# Altium schematic sheet main.SchDoc: Main Schema Block
size A3; SheetNumber: 2; SheetTotal: 17
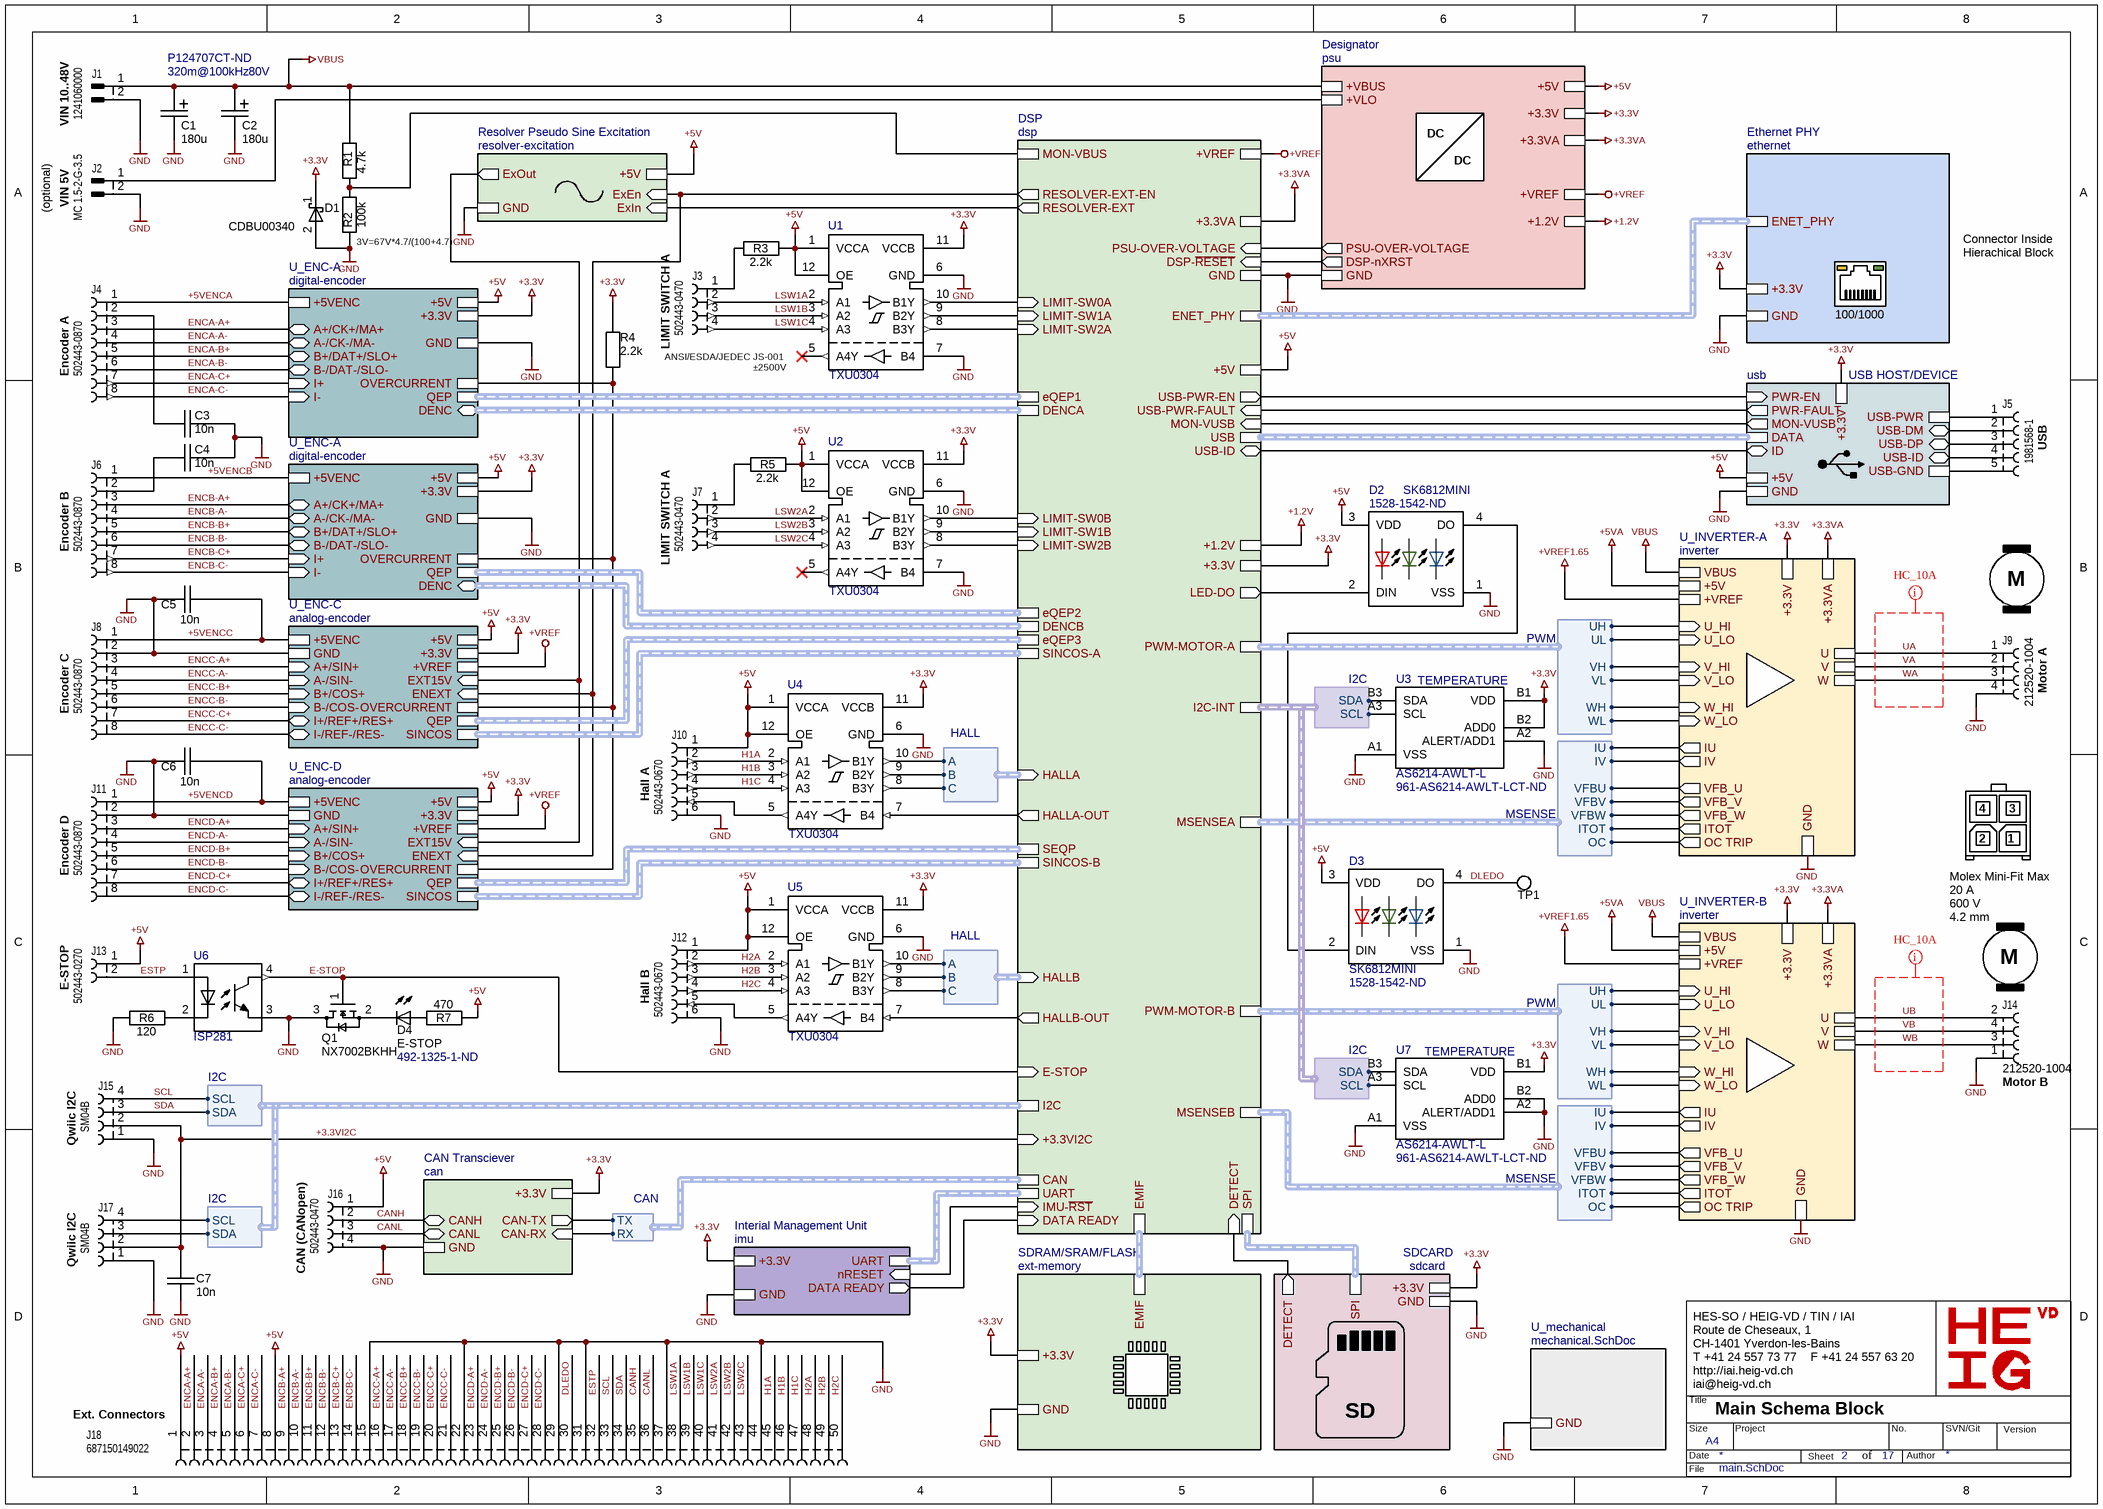
[diagram p0: main.SchDoc]

## Parts
C1  180u  Voltage: 80V  ESR: 320m@100kHz  Supplier Part Number 1: P124707CT-ND  [CAP_EEEFK1K151AV]
C2  180u  [CAP_EEEFK1K151AV]
C3  10n  [SM/C0402]
C4  10n  [SM/C0402]
C5  10n  [SM/C0402]
C6  10n  [SM/C0402]
C7  10n  [SM/C0402]
D1  CDBU00340  [SM/D0603/SOD523F]
D2  SK6812MINI  Supplier Part Number 1: 1528-1542-ND  [LED_SK6812]
D3  SK6812MINI  Supplier Part Number 1: 1528-1542-ND  [LED_SK6812]
D4  E-STOP  Supplier Part Number 1: 492-1325-1-ND  [SM/LED0603]
J1  1241060000  Function: VIN 10..48V  [CONN 2POS WEIDMULLER 5.08mm]
J2  MC 1.5-2-G-3.5  Function: VIN 5V  [CONN2/PHOENIX/MC 1.5-2-G-3.5]
J3  502443-0470  Function: LIMIT SWITCH A  [MOLEX/5024430470/CLIK-MATE/2mm]
J4  502443-0870  Function: Encoder A  [MOLEX/5024430870/CLIK-MATE/2mm]
J5  1981568-1  Function: USB  [TE/1981568-1/USB]
J6  502443-0870  Function: Encoder B  [MOLEX/5024430870/CLIK-MATE/2mm]
J7  502443-0470  Function: LIMIT SWITCH A  [MOLEX/5024430470/CLIK-MATE/2mm]
J8  502443-0870  Function: Encoder C  [MOLEX/5024430870/CLIK-MATE/2mm]
J9  212520-1004  Function: Motor A  [MOLEX/2125201004]
J10  502443-0670  Function: Hall A  [MOLEX/5024430670/CLIK-MATE/2mm]
J11  502443-0870  Function: Encoder D  [MOLEX/5024430870/CLIK-MATE/2mm]
J12  502443-0670  Function: Hall B  [MOLEX/5024430670/CLIK-MATE/2mm]
J13  502443-0270  Function: E-STOP  [MOLEX/5024430270/CLIK-MATE/2mm]
J14  212520-1004  Function: Motor B  [MOLEX/2125201004]
J15  SM04B  Function: Qwiic I2C  [QWIIC-SM04B-SRSS-TB]
J16  502443-0470  Function: CAN (CANopen)  [MOLEX/5024430470/CLIK-MATE/2mm]
J17  SM04B  Function: Qwiic I2C  [QWIIC-SM04B-SRSS-TB]
J18  687150149022  Function: Ext. Connectors  [687150149022]
Q1  NX7002BKHH  [SOT8001/DFN0606-3]
R1  4.7k  [SM/R0402]
R2  100k  [SM/R0805]
R3  2.2k  [SM/R0402]
R4  2.2k  [SM/R0402]
R5  2.2k  [SM/R0402]
R6  120  [SM/R0402]
R7  470  [SM/R0603]
TP1  RCUCTE  [TP/RCUCT]  (value not drawn)
U1  TXU0304  [QFN40P170X200X55-12N]
U2  TXU0304  [QFN40P170X200X55-12N]
U3  AS6214-AWLT-L  Supplier Part Number 1: 961-AS6214-AWLT-LCT-ND  [AS6214-AWLT-L_AMS]
U4  TXU0304  [QFN40P170X200X55-12N]
U5  TXU0304  [QFN40P170X200X55-12N]
U6  ISP281  [SOIC-4]
U7  AS6214-AWLT-L  Supplier Part Number 1: 961-AS6214-AWLT-LCT-ND  [AS6214-AWLT-L_AMS]

## Sub-sheets
CAN Transciever = can: CANL (bidir), CAN-RX (in), CANH (bidir), GND, CAN-TX (out), +3.3V
Designator = psu: DSP-nXRST (out), +3.3VA, +1.2V, +VBUS, +VLO, GND, +3.3V, +5V, +VREF, PSU-OVER-VOLTAGE (out)
DSP = dsp: SINCOS-B (harness SINCOS), MSENSEB (harness MSENSE), MSENSEA (harness MSENSE), SINCOS-A (harness SINCOS), I2C (harness I2C), EMIF (harness EMIF), PWM-MOTOR-A (harness PWM), CAN (harness CAN), ENET_PHY (harness ETHERNET), PWM-MOTOR-B (harness PWM), +3.3VI2C (in), USB-PWR-EN (out), USB-ID (bidir), USB-PWR-FAULT (in), USB (harness USB), HALLA (in, harness HALL), HALLB (in, harness HALL), LIMIT-SW0A (in), LIMIT-SW1A (in), LIMIT-SW2A (in), LIMIT-SW0B (in), LIMIT-SW1B (in), LIMIT-SW2B (in), eQEP3 (harness EQEP), SPI (harness SPI), eQEP2 (harness EQEP), E-STOP (in), eQEP1 (harness EQEP), DATA READY (in), +3.3V, +3.3VA, GND, +1.2V, +5V, HALLA-OUT (out), HALLB-OUT (out), I2C-INT (harness I2C), LED-DO (out), UART (harness UART), RESOLVER-EXT-EN (out), RESOLVER-EXT (out), IMU-~{RST} (in), DSP-~{RESET} (in), PSU-OVER-VOLTAGE (in), DENCA (harness DENC), SEQP (harness EQEP), DETECT (in), MON-VBUS, MON-VUSB (in), DENCB (harness DENC), +VREF
Ethernet PHY = ethernet: GND, ENET_PHY (harness ETHERNET), +3.3V
Interial Management Unit = imu: DATA READY (out), nRESET (in), UART (harness UART), GND, +3.3V
Resolver Pseudo Sine Excitation = resolver-excitation: ExEn (in), +5V, ExOut (out), GND, ExIn (in)
SDCARD = sdcard: +3.3V, SPI (harness SPI), GND, DETECT (out)
SDRAM/SRAM/FLASH = ext-memory: +3.3V, EMIF (harness EMIF), GND
U_ENC-A = digital-encoder: I+ (in), +5VENC, +3.3V, +5V, I- (in), B+/DAT+/SLO+ (bidir), A-/CK-/MA- (bidir), A+/CK+/MA+ (bidir), B-/DAT-/SLO- (bidir), DENC (bidir, harness DENC), QEP (harness EQEP), GND, OVERCURRENT
U_ENC-A = digital-encoder: I+ (in), +5VENC, +3.3V, +5V, I- (in), B+/DAT+/SLO+ (bidir), A-/CK-/MA- (bidir), A+/CK+/MA+ (bidir), B-/DAT-/SLO- (bidir), DENC (bidir, harness DENC), QEP (harness EQEP), GND, OVERCURRENT
U_ENC-C = analog-encoder: SINCOS (harness SINCOS), +5VENC, EXT15V (in), OVERCURRENT, +3.3V, +5V, I+/REF+/RES+ (bidir), I-/REF-/RES- (bidir), B-/COS- (in), B+/COS+ (in), A+/SIN+ (in), A-/SIN- (in), ENEXT (in), +VREF, GND, QEP (harness EQEP)
U_ENC-D = analog-encoder: SINCOS (harness SINCOS), +5VENC, EXT15V (in), OVERCURRENT, +3.3V, +5V, I+/REF+/RES+ (bidir), I-/REF-/RES- (bidir), B-/COS- (in), B+/COS+ (in), A+/SIN+ (in), A-/SIN- (in), ENEXT (in), +VREF, GND, QEP (harness EQEP)
U_INVERTER-A = inverter: U_LO (in), V_HI (in), U, VBUS, V, IU (out), W, V_LO (in), IV (out), U_HI (in), W_HI (in), W_LO (in), OC TRIP (out), VFB_W (out), ITOT (out), VFB_V (out), VFB_U (out), GND, +3.3V, +5V, +VREF, +3.3VA
U_INVERTER-B = inverter: U_LO (in), V_HI (in), U, VBUS, V, IU (out), W, V_LO (in), IV (out), U_HI (in), W_HI (in), W_LO (in), OC TRIP (out), VFB_W (out), ITOT (out), VFB_V (out), +VREF, VFB_U (out), +5V, GND, +3.3V, +3.3VA
U_mechanical = mechanical.SchDoc: GND
USB HOST/DEVICE = usb: GND, +5V, USB-DP (bidir), USB-DM (bidir), USB-PWR, USB-GND, USB-ID (bidir), PWR-EN (in), MON-VUSB (out), ID (bidir), DATA (harness USB), PWR-FAULT (out), +3.3V

## Harnesses
I2C: SCL, SDA
CAN: RX, TX
PWM: UH, UL, VH, VL, WH, WL
MSENSE: IU, IV, VFBU, VFBV, ITOT, OC, VFBW
HALL: A, B, C

## Nets
+1.2V: sheet DSP/+1.2V, sheet Designator/+1.2V
+3.3V: D1.1(K) R4.2 U1.11(VCCB) U2.11(VCCB) U3.B1(VDD) U3.B2(ADD0) U4.11(VCCB) U5.11(VCCB) U7.B1(VDD) ; sheet U_INVERTER-A/+3.3V, sheet U_ENC-A/+3.3V, sheet CAN Transciever/+3.3V, sheet U_INVERTER-B/+3.3V, sheet DSP/+3.3V, sheet Ethernet PHY/+3.3V, sheet Designator/+3.3V, sheet SDRAM/SRAM/FLASH/+3.3V, sheet USB HOST/DEVICE/+3.3V, sheet U_ENC-C/+3.3V, sheet Interial Management Unit/+3.3V, sheet U_ENC-A/+3.3V, sheet SDCARD/+3.3V, sheet U_ENC-D/+3.3V
+3.3VA: sheet U_INVERTER-A/+3.3VA, sheet U_INVERTER-B/+3.3VA, sheet DSP/+3.3VA, sheet Designator/+3.3VA
+5V: D2.3(VDD) D3.3(VDD) J10.1 J12.1 J13.1 J16.1 J18.1 J18.8 R3.2 R5.2 R7.2 U1.1(VCCA) U1.12(OE) U2.1(VCCA) U2.12(OE) U4.1(VCCA) U4.12(OE) U5.1(VCCA) U5.12(OE) ; sheet U_ENC-A/+5V, sheet DSP/+5V, sheet Designator/+5V, sheet USB HOST/DEVICE/+5V, sheet Resolver Pseudo Sine Excitation/+5V, sheet U_ENC-C/+5V, sheet U_ENC-A/+5V, sheet U_ENC-D/+5V
+5VA: sheet U_INVERTER-A/+5V, sheet U_INVERTER-B/+5V
+VREF: sheet DSP/+VREF, sheet Designator/+VREF, sheet U_ENC-C/+VREF, sheet U_ENC-D/+VREF
+VREF1.65: sheet U_INVERTER-A/+VREF, sheet U_INVERTER-B/+VREF
GND: C1.2(-) C2.2(-) C3.1 C4.1 C5.2 C6.2 C7.2 D1.2(A) D2.1(VSS) D3.1(VSS) J1.2 J2.2 J8.2 J9.4 J10.6 J11.2 J12.6 J14.1 J15.1 J16.4 J17.1 J18.15 J18.22 J18.29 J18.31 J18.37 J18.44 Q1.3(VCC) R2.2 R6.1 U1.6(GND) U1.7(B4) U2.6(GND) U2.7(B4) U3.A1(VSS) U3.A2(ALERT/ADD1) U4.6(GND) U5.6(GND) U6.3(E) U7.A1(VSS) U7.A2(ALERT/ADD1) U7.B2(ADD0) ; sheet U_INVERTER-A/GND, sheet U_ENC-A/GND, sheet CAN Transciever/GND, sheet U_INVERTER-B/GND, sheet DSP/GND, sheet Ethernet PHY/GND, sheet Designator/GND, sheet SDRAM/SRAM/FLASH/GND, sheet USB HOST/DEVICE/GND, sheet Resolver Pseudo Sine Excitation/GND, sheet U_ENC-C/GND, sheet Interial Management Unit/GND, sheet U_ENC-A/GND, sheet SDCARD/GND, sheet U_ENC-D/GND, sheet U_mechanical/GND
VBUS: C1.1(+) C2.1(+) J1.1 R1.1 ; sheet U_INVERTER-A/VBUS, sheet U_INVERTER-B/VBUS, sheet Designator/+VBUS
+3.3VI2C: C7.1 J15.2 J17.2 ; sheet DSP/+3.3VI2C
+5VENCA: J4.1 ; sheet U_ENC-A/+5VENC
+5VENCB: J6.1 ; sheet U_ENC-A/+5VENC
+5VENCC: C5.1 J8.1 ; sheet U_ENC-C/+5VENC
+5VENCD: C6.1 J11.1 ; sheet U_ENC-D/+5VENC
CANH: J16.2 J18.35 ; sheet CAN Transciever/CANH
CANL: J16.3 J18.36 ; sheet CAN Transciever/CANL
DLEDO: D3.4(DO) J18.30 TP1.1
E-STOP: Q1.1(VCC) U6.4(C) ; sheet DSP/E-STOP
ENCA-A+: J4.3 J18.2 ; sheet U_ENC-A/A+/CK+/MA+
ENCA-A-: J4.4 J18.3 ; sheet U_ENC-A/A-/CK-/MA-
ENCA-B+: J4.5 J18.4 ; sheet U_ENC-A/B+/DAT+/SLO+
ENCA-B-: J4.6 J18.5 ; sheet U_ENC-A/B-/DAT-/SLO-
ENCA-C+: J4.7 J18.6 ; sheet U_ENC-A/I+
ENCA-C-: J4.8 J18.7 ; sheet U_ENC-A/I-
ENCB-A+: J6.3 J18.9 ; sheet U_ENC-A/A+/CK+/MA+
ENCB-A-: J6.4 J18.10 ; sheet U_ENC-A/A-/CK-/MA-
ENCB-B+: J6.5 J18.11 ; sheet U_ENC-A/B+/DAT+/SLO+
ENCB-B-: J6.6 J18.12 ; sheet U_ENC-A/B-/DAT-/SLO-
ENCB-C+: J6.7 J18.13 ; sheet U_ENC-A/I+
ENCB-C-: J6.8 J18.14 ; sheet U_ENC-A/I-
ENCC-A+: J8.3 J18.16 ; sheet U_ENC-C/A+/SIN+
ENCC-A-: J8.4 J18.17 ; sheet U_ENC-C/A-/SIN-
ENCC-B+: J8.5 J18.18 ; sheet U_ENC-C/B+/COS+
ENCC-B-: J8.6 J18.19 ; sheet U_ENC-C/B-/COS-
ENCC-C+: J8.7 J18.20 ; sheet U_ENC-C/I+/REF+/RES+
ENCC-C-: J8.8 J18.21 ; sheet U_ENC-C/I-/REF-/RES-
ENCD-A+: J11.3 J18.23 ; sheet U_ENC-D/A+/SIN+
ENCD-A-: J11.4 J18.24 ; sheet U_ENC-D/A-/SIN-
ENCD-B+: J11.5 J18.25 ; sheet U_ENC-D/B+/COS+
ENCD-B-: J11.6 J18.26 ; sheet U_ENC-D/B-/COS-
ENCD-C+: J11.7 J18.27 ; sheet U_ENC-D/I+/REF+/RES+
ENCD-C-: J11.8 J18.28 ; sheet U_ENC-D/I-/REF-/RES-
ESTP: J13.2 J18.32 U6.1(A)
H1A: J10.2 J18.45 U4.2(A1)
H1B: J10.3 J18.46 U4.3(A2)
H1C: J10.4 J18.47 U4.4(A3)
H2A: J12.2 J18.48 U5.2(A1)
H2B: J12.3 J18.49 U5.3(A2)
H2C: J12.4 J18.50 U5.4(A3)
LSW1A: J3.2 J18.38 U1.2(A1)
LSW1B: J3.3 J18.39 U1.3(A2)
LSW1C: J3.4 J18.40 U1.4(A3)
LSW2A: J7.2 J18.41 U2.2(A1)
LSW2B: J7.3 J18.42 U2.3(A2)
LSW2C: J7.4 J18.43 U2.4(A3)
SCL: J15.4 J17.4 J18.33 ; sheet DSP/I2C.SCL
SDA: J15.3 J17.3 J18.34 ; sheet DSP/I2C.SDA
UA: J9.1 ; sheet U_INVERTER-A/U
UB: J14.2 ; sheet U_INVERTER-B/U
VA: J9.2 ; sheet U_INVERTER-A/V
VB: J14.4 ; sheet U_INVERTER-B/V
WA: J9.3 ; sheet U_INVERTER-A/W
WB: J14.3 ; sheet U_INVERTER-B/W
NetC3_2: C3.2 J4.2
NetC4_2: C4.2 J6.2
NetD2_2: D2.2(DIN) ; sheet DSP/LED-DO
NetD2_4: D2.4(DO) D3.2(DIN)
NetD4_1: D4.1 R7.1
NetD4_2: D4.2 Q1.2(VCC)
NetJ2_1: J2.1 ; sheet Designator/+VLO
NetJ3_1: J3.1 R3.1
NetJ5_1: J5.1 ; sheet USB HOST/DEVICE/USB-PWR
NetJ5_2: J5.2 ; sheet USB HOST/DEVICE/USB-DM
NetJ5_3: J5.3 ; sheet USB HOST/DEVICE/USB-DP
NetJ5_4: J5.4 ; sheet USB HOST/DEVICE/USB-ID
NetJ5_5: J5.5 ; sheet USB HOST/DEVICE/USB-GND
NetJ7_1: J7.1 R5.1
NetJ10_5: J10.5 U4.5(A4Y)
NetJ12_5: J12.5 U5.5(A4Y)
NetR1_2: R1.2 R2.1 ; sheet DSP/MON-VBUS
NetR4_1: R4.1 ; sheet U_ENC-A/OVERCURRENT, sheet U_ENC-C/OVERCURRENT, sheet U_ENC-A/OVERCURRENT, sheet U_ENC-D/OVERCURRENT
NetR6_2: R6.2 U6.2(K)
NetU1_8: U1.8(B3Y) ; sheet DSP/LIMIT-SW2A
NetU1_9: U1.9(B2Y) ; sheet DSP/LIMIT-SW1A
NetU1_10: U1.10(B1Y) ; sheet DSP/LIMIT-SW0A
NetU2_8: U2.8(B3Y) ; sheet DSP/LIMIT-SW2B
NetU2_9: U2.9(B2Y) ; sheet DSP/LIMIT-SW1B
NetU2_10: U2.10(B1Y) ; sheet DSP/LIMIT-SW0B
NetU3_A3: U3.A3(SCL) U7.A3(SCL) ; sheet DSP/I2C-INT.SCL
NetU3_B3: U3.B3(SDA) U7.B3(SDA) ; sheet DSP/I2C-INT.SDA
NetU4_7: U4.7(B4) ; sheet DSP/HALLA-OUT
NetU4_8: U4.8(B3Y) ; sheet DSP/HALLA.C
NetU4_9: U4.9(B2Y) ; sheet DSP/HALLA.B
NetU4_10: U4.10(B1Y) ; sheet DSP/HALLA.A
NetU5_7: U5.7(B4) ; sheet DSP/HALLB-OUT
NetU5_8: U5.8(B3Y) ; sheet DSP/HALLB.C
NetU5_9: U5.9(B2Y) ; sheet DSP/HALLB.B
NetU5_10: U5.10(B1Y) ; sheet DSP/HALLB.A
(unnamed): sheet U_INVERTER-A/U_LO, sheet DSP/PWM-MOTOR-A.UL
(unnamed): sheet U_INVERTER-A/V_HI, sheet DSP/PWM-MOTOR-A.VH
(unnamed): sheet U_INVERTER-A/IU, sheet DSP/MSENSEA.IU
(unnamed): sheet U_INVERTER-A/V_LO, sheet DSP/PWM-MOTOR-A.VL
(unnamed): sheet U_INVERTER-A/IV, sheet DSP/MSENSEA.IV
(unnamed): sheet U_INVERTER-A/U_HI, sheet DSP/PWM-MOTOR-A.UH
(unnamed): sheet U_INVERTER-A/W_HI, sheet DSP/PWM-MOTOR-A.WH
(unnamed): sheet U_INVERTER-A/W_LO, sheet DSP/PWM-MOTOR-A.WL
(unnamed): sheet U_INVERTER-A/OC TRIP, sheet DSP/MSENSEA.OC
(unnamed): sheet U_INVERTER-A/VFB_W, sheet DSP/MSENSEA.VFBW
(unnamed): sheet U_INVERTER-A/ITOT, sheet DSP/MSENSEA.ITOT
(unnamed): sheet U_INVERTER-A/VFB_V, sheet DSP/MSENSEA.VFBV
(unnamed): sheet U_INVERTER-A/VFB_U, sheet DSP/MSENSEA.VFBU
(unnamed): sheet CAN Transciever/CAN-RX, sheet DSP/CAN.RX
(unnamed): sheet CAN Transciever/CAN-TX, sheet DSP/CAN.TX
(unnamed): sheet U_INVERTER-B/U_LO, sheet DSP/PWM-MOTOR-B.UL
(unnamed): sheet U_INVERTER-B/V_HI, sheet DSP/PWM-MOTOR-B.VH
(unnamed): sheet U_INVERTER-B/IU, sheet DSP/MSENSEB.IU
(unnamed): sheet U_INVERTER-B/V_LO, sheet DSP/PWM-MOTOR-B.VL
(unnamed): sheet U_INVERTER-B/IV, sheet DSP/MSENSEB.IV
(unnamed): sheet U_INVERTER-B/U_HI, sheet DSP/PWM-MOTOR-B.UH
(unnamed): sheet U_INVERTER-B/W_HI, sheet DSP/PWM-MOTOR-B.WH
(unnamed): sheet U_INVERTER-B/W_LO, sheet DSP/PWM-MOTOR-B.WL
(unnamed): sheet U_INVERTER-B/OC TRIP, sheet DSP/MSENSEB.OC
(unnamed): sheet U_INVERTER-B/VFB_W, sheet DSP/MSENSEB.VFBW
(unnamed): sheet U_INVERTER-B/ITOT, sheet DSP/MSENSEB.ITOT
(unnamed): sheet U_INVERTER-B/VFB_V, sheet DSP/MSENSEB.VFBV
(unnamed): sheet U_INVERTER-B/VFB_U, sheet DSP/MSENSEB.VFBU
(unnamed): sheet DSP/USB-PWR-EN, sheet USB HOST/DEVICE/PWR-EN
(unnamed): sheet DSP/USB-ID, sheet USB HOST/DEVICE/ID
(unnamed): sheet DSP/USB-PWR-FAULT, sheet USB HOST/DEVICE/PWR-FAULT
(unnamed): sheet DSP/DATA READY, sheet Interial Management Unit/DATA READY
(unnamed): sheet DSP/RESOLVER-EXT-EN, sheet Resolver Pseudo Sine Excitation/ExEn, sheet U_ENC-C/ENEXT, sheet U_ENC-D/ENEXT
(unnamed): sheet DSP/RESOLVER-EXT, sheet Resolver Pseudo Sine Excitation/ExIn
(unnamed): sheet DSP/IMU-~{RST}, sheet Interial Management Unit/nRESET
(unnamed): sheet DSP/DSP-~{RESET}, sheet Designator/DSP-nXRST
(unnamed): sheet DSP/PSU-OVER-VOLTAGE, sheet Designator/PSU-OVER-VOLTAGE
(unnamed): sheet DSP/DETECT, sheet SDCARD/DETECT
(unnamed): sheet DSP/MON-VUSB, sheet USB HOST/DEVICE/MON-VUSB
(unnamed): sheet Resolver Pseudo Sine Excitation/ExOut, sheet U_ENC-C/EXT15V, sheet U_ENC-D/EXT15V

Not connected (* = marked no-connect by the designer): U1 5(A4Y)*; U2 5(A4Y)*

## Buses and harness runs
harness sheet DSP/DENCA = sheet U_ENC-A/DENC
harness sheet DSP/DENCB = sheet U_ENC-A/DENC
harness sheet DSP/EMIF = sheet SDRAM/SRAM/FLASH/EMIF
harness sheet DSP/ENET_PHY = sheet Ethernet PHY/ENET_PHY
harness sheet DSP/eQEP1 = sheet U_ENC-A/QEP
harness sheet DSP/eQEP2 = sheet U_ENC-A/QEP
harness sheet DSP/eQEP3 = sheet U_ENC-C/QEP
harness sheet DSP/SEQP = sheet U_ENC-D/QEP
harness sheet DSP/SINCOS-A = sheet U_ENC-C/SINCOS
harness sheet DSP/SINCOS-B = sheet U_ENC-D/SINCOS
harness sheet DSP/SPI = sheet SDCARD/SPI
harness sheet DSP/UART = sheet Interial Management Unit/UART
harness sheet DSP/USB = sheet USB HOST/DEVICE/DATA

## Layout directives
net class HC_10A: UA, UB, VA, VB, WA, WB

## Notes on the sheet
- (optional)
- DC
- (near R2) 3V=67V*4.7/(100+4.7)
- 100/1000
- Connector Inside
  Hierachical Block
- ANSI/ESDA/JEDEC JS-001
  ±2500V
- M
- (near U3) TEMPERATURE
- 2
- 4
- 1
- 3
- Molex Mini-Fit Max
  20 A
  600 V
  4.2 mm
- (near J14) M
- (near U7) TEMPERATURE
- SD
- HES-SO / HEIG-VD / TIN / IAI
  Route de Cheseaux, 1
  CH-1401 Yverdon-les-Bains
  T +41 24 557 73 77    F +41 24 557 63 20
  http://iai.heig-vd.ch
  iai@heig-vd.ch
- Title
- Size
- Date
- A4
- Project
- Sheet
- of
- No.
- Author
- SVN/Git
- Version
- File

## Library data of the parts
C1 = C+: Capacitor; Supplier 1: Digi-Key
C2 = C+: Capacitor; Voltage: 80V; ESR: 320m@100kHz; Supplier 1: Digi-Key; Supplier Part Number 1: P124707CT-ND
C3-C7 = C: C0402C103K8RAC7867; Dielectric: X7R; Voltage: 10V; Supplier 1: Digi-Key; Supplier Part Number 1: 399-C0402C103K8RAC7867CT-ND; Value: 10n
D1 = D SCHOTTKY: Supplier 1: Digi-Key; Supplier Part Number 1: S1AB-FDICT-ND
D2 D3 = SK6812MINI: Addressable Lighting series 10 LED Discrete Serial (Shift Register) Red, Green, Blue (RGB) 3.50mm L x 3.50mm W; Supplier 1: Digi-Key
D4 = LED: Supplier 1: Digi-Key
J1 J2 = CONN 2 Plug
  J1: Supplier 1: Digi-Key; Supplier Part Number 1: 281-4411-ND
J3 J7 = MOLEX/CONN 4 Clik-Mate 2mm Vertical: CLIK-Mate Vertical Receptacle, PCB Receptacle, Surface Mount, 1 Rows, 4 Contacts, 2mm Pitch, Molex; Supplier 1: Distrelec; Supplier Part Number 1: 30161193
J4 J6 J8 J11 = MOLEX/CONN 8 Clik-Mate Vertical 2mm: CLIK-Mate Vertical Receptacle, PCB Receptacle, Surface Mount, 1 Rows, 8 Contacts, 2mm Pitch, Molex; Supplier 1: Distrelec; Supplier Part Number 1: 30161195
J5 = CONN 5 Socket: USB - micro B USB 2.0 Receptacle Connector 5 Position Surface Mount, Right Angle; Supplier 1: Digi-Key; Supplier Part Number 1: A97800CT-ND
J9 J14 = CONN 4 Socket
J10 J12 = MOLEX/CONN 6 Clik-Mate Vertical 2mm: CLIK-Mate Vertical Receptacle, PCB Receptacle, Surface Mount, 1 Rows, 6 Contacts, 2mm Pitch, Molex; Supplier 1: Distrelec; Supplier Part Number 1: 30161194
J13 = CONN 2 Socket: Supplier 1: Digi-Key; Supplier Part Number 1: WM15808CT-ND
J15 J17 = JST/CONN 4 Socket (Qwiic): JST Qwiic Connector; Supplier 1: Digi-Key; Supplier Part Number 1: 455-2645-6-ND
J16 = MOLEX/CONN 4 Clik-Mate Vertical 2mm: CLIK-Mate Vertical Receptacle, PCB Receptacle, Surface Mount, 1 Rows, 4 Contacts, 2mm Pitch, Molex; Supplier 1: Distrelec; Supplier Part Number 1: 30161193
J18 = CONN 50 Socket
Q1 = 2N7002: N-Channel 60 V 350mA (Ta) 380mW (Ta), 2.8W (Tc) Surface Mount DFN0606-3; Value: 2N7002; Supplier 1: Digi-Key; Supplier Part Number 1: 1727-8574-1-ND
R1 = R: 4.7 kOhms ±5% 0.063W, 1/16W Chip Resistor 0402 (1005 Metric) Moisture Resistant Thick Film; Supplier 1: Digi-Key; Supplier Part Number 1: 311-4.7KJRCT-ND; Value: 4.7k
R2 R6 = R: Chip Resistor SMD; Supplier 1: Digi-Key
  R2: Supplier Part Number 1: 311-100KLRCT-ND; Value: 100k
  R6: Value: 120; Supplier Part Number 1: 311-120LRCT-ND
R3-R5 = R: RC0402FR-072K2L; Value: 120; Supplier 1: Digi-Key; Supplier Part Number 1: 311-2.20KLRCT-ND
R7 = R: Chip Resistor SMD; Value: 1k
TP1 = TP: PC Test Point Plating Surface Mount Mounting Type; Supplier 1: Digi-Key; Supplier Part Number 1: 2019-RCUCTECT-ND
U1 U2 U4 U5 = TXU0304: FOUR CHANNEL UNIDIRECTIONAL LEVE / Voltage Level Translator Unidirectional 1 Circuit 4 Channel 200Mbps 12-UQFN (1.7x2); MP: TXB0104RGYR; Package: None; Price: None; Value: *; Availability: Unavailable; Supplier 1: Digi-Key; Supplier Part Number 1: 296-TXU0304RUTRCT-ND
U3 U7 = AS621x: Temperature Sensor Digital, Local -40°C ~ 125°C 16 b 6-WLCSP (1.5x1); Supplier 1: Digi-Key
U6 = ISP281: OPTOISOLATR 5KV TRANSISTOR 4-SMD; Value: ISP281; Supplier 1: Digi-Key; Supplier Part Number 1: 58-ISP281DCT-ND